# Altium schematic sheet sch.SchDoc
size A3
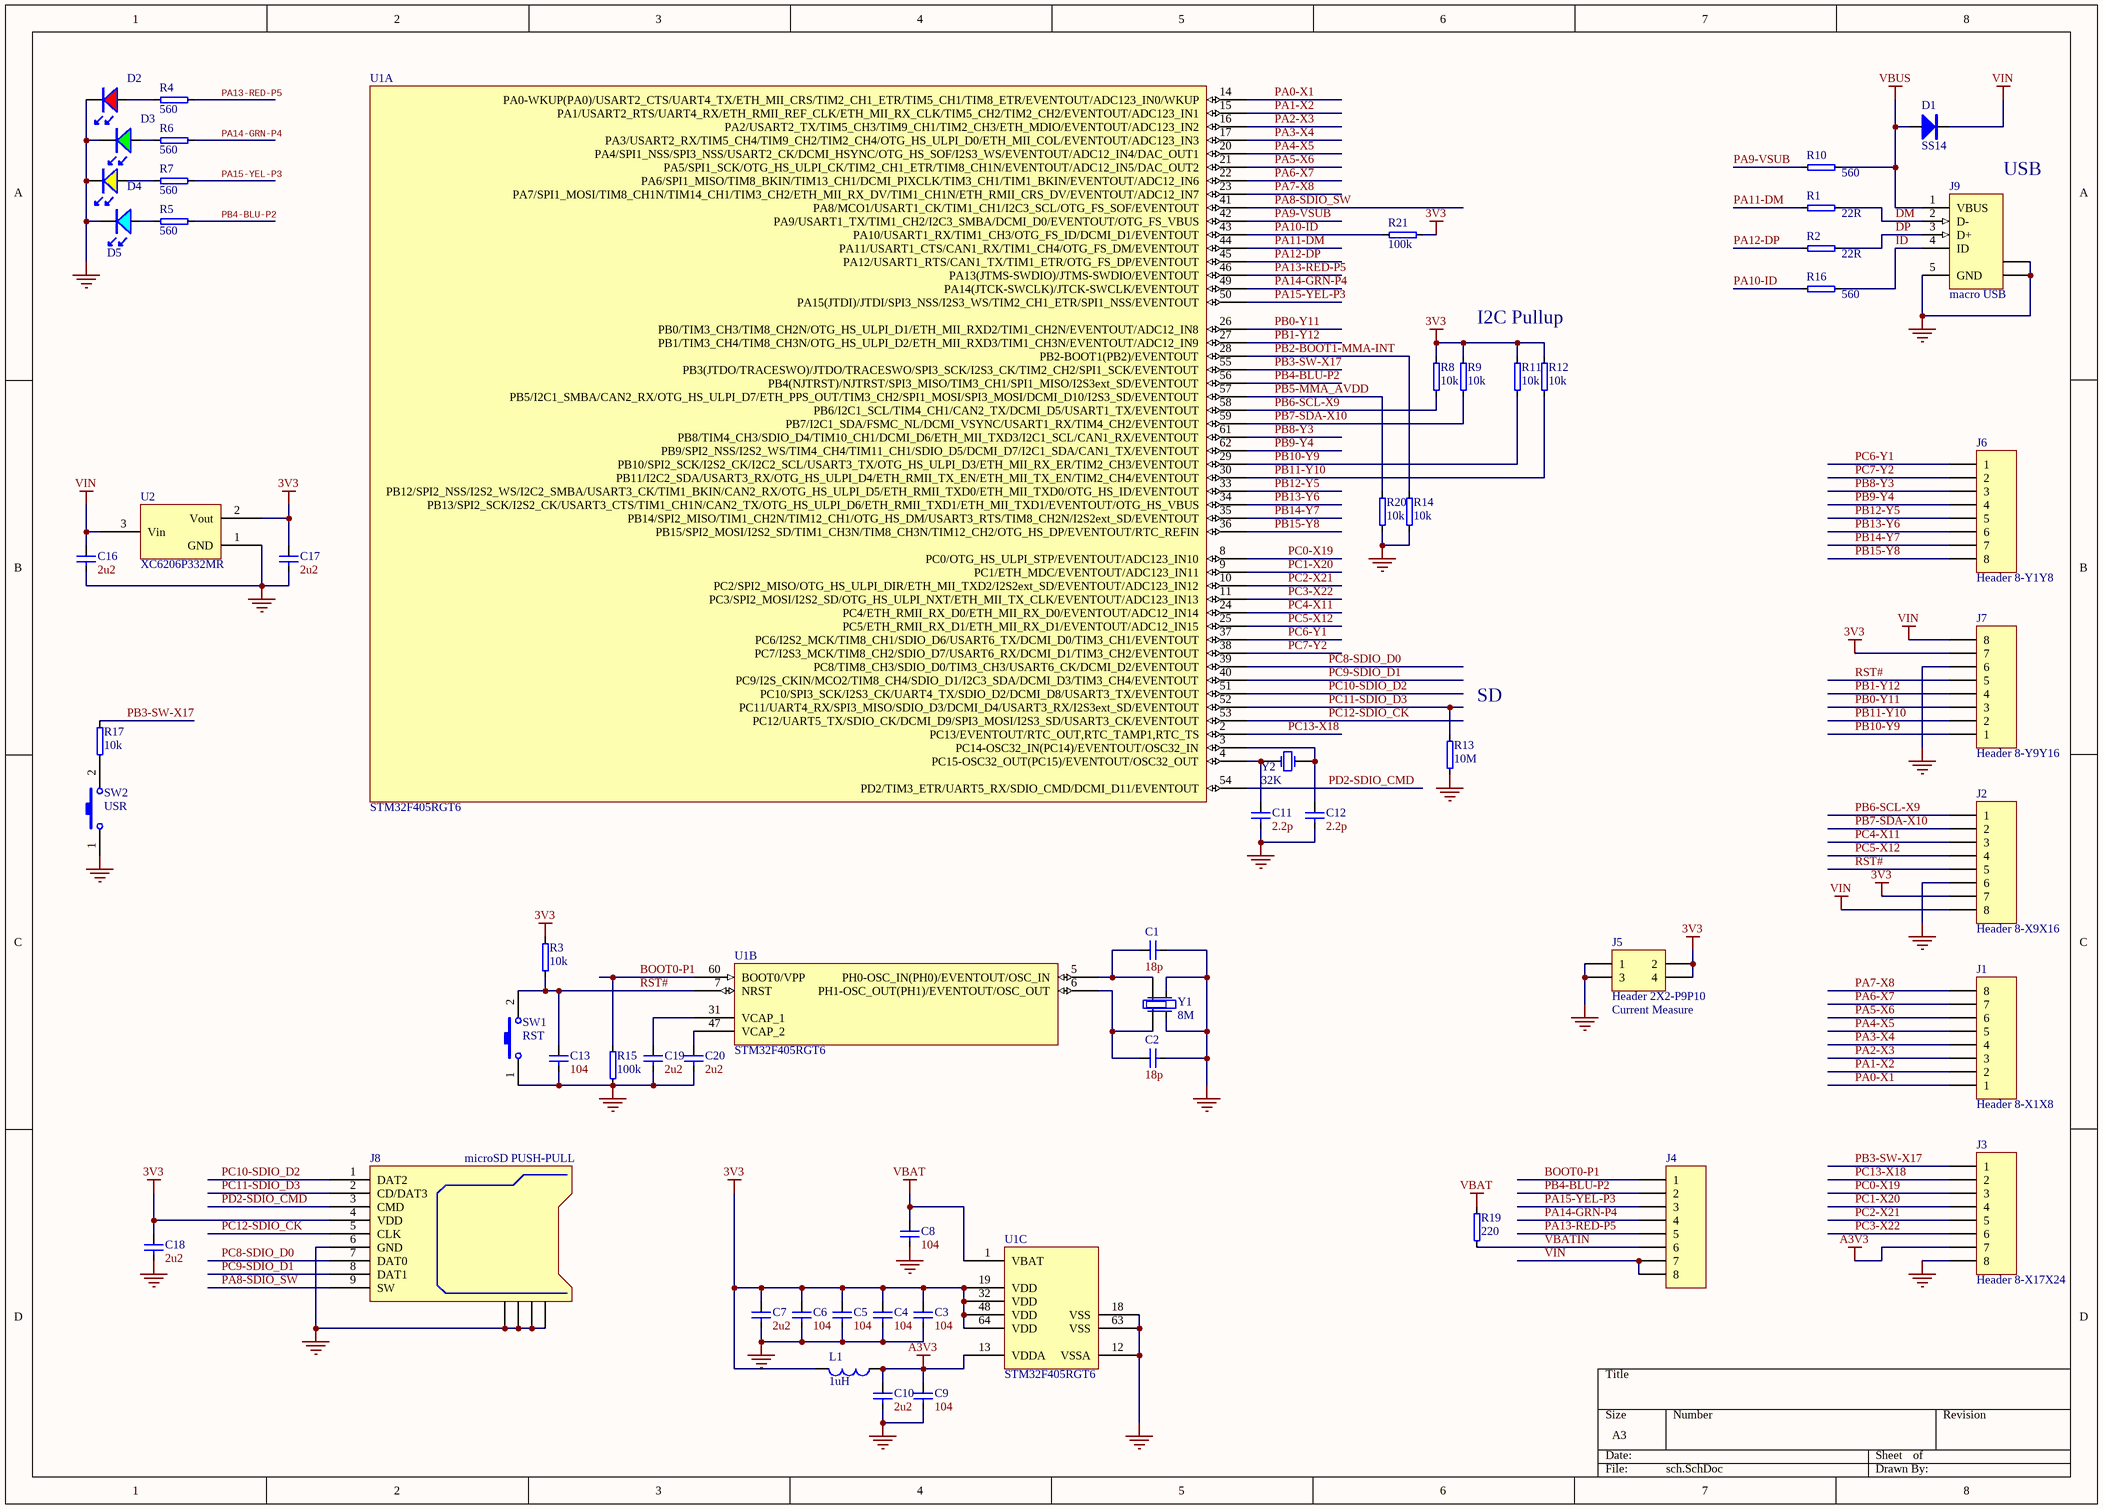
[diagram p0: sch.SchDoc]

## Parts
C1  18p  [SMD0603]
C2  18p  [SMD0603]
C3  104  [SMD0603]
C4  104  [SMD0603]
C5  104  [SMD0603]
C6  104  [SMD0603]
C7  2u2  [SMD0805]
C8  104  [SMD0603]
C9  104  [SMD0603]
C10  2u2  [SMD0805]
C11  2.2p  [SMD0603]
C12  2.2p  [SMD0603]
C13  104  [SMD0603]
C16  2u2  [SMD0805]
C17  2u2  [SMD0805]
C18  2u2  [SMD0805]
C19  2u2  [SMD0805]
C20  2u2  [SMD0805]
D1  SS14  [SS24 - small]
D2  LED RED  [LED0603]  (value not drawn)
D3  LED GREEN  [LED0603]  (value not drawn)
D4  LED Yellow  [LED0603]  (value not drawn)
D5  LED Blue  [LED0603]  (value not drawn)
J1  Header 8-X1X8  [HDR1X8]
J2  Header 8-X9X16  [HDR1X8]
J3  Header 8-X17X24  [HDR1X8]
J4  (no value)  [HDR1X8]
J5  Header 2X2-P9P10  [HDR2X2]
J6  Header 8-Y1Y8  [HDR1X8]
J7  Header 8-Y9Y16  [HDR1X8]
J8  microSD PUSH-PULL  [microSD-1]
J9  macro USB  [MicroUSB]
L1  1uH  [SMD0603]
R1  22R  [SMD0603]
R2  22R  [SMD0603]
R3  10k  [SMD0603]
R4  560  [SMD0603]
R5  560  [SMD0603]
R6  560  [SMD0603]
R7  560  [SMD0603]
R8  10k  [SMD0603]
R9  10k  [SMD0603]
R10  560  [SMD0603]
R11  10k  [SMD0603]
R12  10k  [SMD0603]
R13  10M  [SMD0603]
R14  10k  [SMD0603]
R15  100k  [SMD0603]
R16  560  [SMD0603]
R17  10k  [SMD0603]
R19  220  [SMD0603]
R20  10k  [SMD0603]
R21  100k  [SMD0603]
SW1  RST  [SW 3x6]
SW2  USR  [SW 3x6]
U1  STM32F405RGT6  [LQFP64_M]  (parts A,B,C of 3)
U2  XC6206P332MR  [SOT-23_N]
Y1  8M  [SMD5032]
Y2  32K  [TXC_9H03200019]

## Nets
3V3: C3.2 C4.2 C5.2 C6.2 C7.2 C17.2 C18.2 J2.7 J5.2 J5.4 J7.7 J8.4(VDD) L1.2 R3.2 R8.1 R9.1 R11.1 R12.1 R21.1 U1.19(VDD) U1.32(VDD) U1.48(VDD) U1.64(VDD) U2.2(Vout)
A3V3: C9.2 C10.2 J3.7 L1.1 U1.13(VDDA)
GND: C1.1 C2.1 C3.1 C4.1 C5.1 C6.1 C7.1 C8.1 C9.1 C10.1 C11.1 C12.1 C13.1 C16.1 C17.1 C18.1 C19.1 C20.1 D2.2 D3.2 D4.2 D5.2 J2.6 J3.8 J5.1 J5.3 J7.6 J8.6(GND) J8.GP1 J8.GP2 J8.GP3 J8.GP4 J9.5(GND) J9.6(SHLD) J9.7(SHLD) R13.2 R14.2 R15.1 R20.2 SW1.1 SW2.1 U1.12(VSSA) U1.18(VSS) U1.63(VSS) U2.1(GND) Y1.2(GND) Y1.4(GND)
VBAT: C8.2 R19.1 U1.1(VBAT)
VBUS: D1.1 J9.1(VBUS) R10.2
VIN: C16.2 D1.2 J2.8 J4.7 J4.8 J7.8 U2.3(Vin)
BOOT0-P1: J4.1 R15.2 U1.60(BOOT0/VPP)
DM: J9.2(D-) R1.2
DP: J9.3(D+) R2.2
ID: J9.4(ID) R16.2
PA0-X1: J1.1 U1.14(PA0-WKUP(PA0)/USART2_CTS/UART4_TX/ETH_MII_CRS/TIM2_CH1_ETR/TIM5_CH1/TIM8_ETR/EVENTOUT/ADC123_IN0/WKUP)
PA1-X2: J1.2 U1.15(PA1/USART2_RTS/UART4_RX/ETH_RMII_REF_CLK/ETH_MII_RX_CLK/TIM5_CH2/TIM2_CH2/EVENTOUT/ADC123_IN1)
PA2-X3: J1.3 U1.16(PA2/USART2_TX/TIM5_CH3/TIM9_CH1/TIM2_CH3/ETH_MDIO/EVENTOUT/ADC123_IN2)
PA3-X4: J1.4 U1.17(PA3/USART2_RX/TIM5_CH4/TIM9_CH2/TIM2_CH4/OTG_HS_ULPI_D0/ETH_MII_COL/EVENTOUT/ADC123_IN3)
PA4-X5: J1.5 U1.20(PA4/SPI1_NSS/SPI3_NSS/USART2_CK/DCMI_HSYNC/OTG_HS_SOF/I2S3_WS/EVENTOUT/ADC12_IN4/DAC_OUT1)
PA5-X6: J1.6 U1.21(PA5/SPI1_SCK/OTG_HS_ULPI_CK/TIM2_CH1_ETR/TIM8_CH1N/EVENTOUT/ADC12_IN5/DAC_OUT2)
PA6-X7: J1.7 U1.22(PA6/SPI1_MISO/TIM8_BKIN/TIM13_CH1/DCMI_PIXCLK/TIM3_CH1/TIM1_BKIN/EVENTOUT/ADC12_IN6)
PA7-X8: J1.8 U1.23(PA7/SPI1_MOSI/TIM8_CH1N/TIM14_CH1/TIM3_CH2/ETH_MII_RX_DV/TIM1_CH1N/ETH_RMII_CRS_DV/EVENTOUT/ADC12_IN7)
PA8-SDIO_SW: J8.9(SW) U1.41(PA8/MCO1/USART1_CK/TIM1_CH1/I2C3_SCL/OTG_FS_SOF/EVENTOUT)
PA9-VSUB: R10.1 U1.42(PA9/USART1_TX/TIM1_CH2/I2C3_SMBA/DCMI_D0/EVENTOUT/OTG_FS_VBUS)
PA10-ID: R16.1 R21.2 U1.43(PA10/USART1_RX/TIM1_CH3/OTG_FS_ID/DCMI_D1/EVENTOUT)
PA11-DM: R1.1 U1.44(PA11/USART1_CTS/CAN1_RX/TIM1_CH4/OTG_FS_DM/EVENTOUT)
PA12-DP: R2.1 U1.45(PA12/USART1_RTS/CAN1_TX/TIM1_ETR/OTG_FS_DP/EVENTOUT)
PA13-RED-P5: J4.5 R4.1 U1.46(PA13(JTMS-SWDIO)/JTMS-SWDIO/EVENTOUT)
PA14-GRN-P4: J4.4 R6.1 U1.49(PA14(JTCK-SWCLK)/JTCK-SWCLK/EVENTOUT)
PA15-YEL-P3: J4.3 R7.1 U1.50(PA15(JTDI)/JTDI/SPI3_NSS/I2S3_WS/TIM2_CH1_ETR/SPI1_NSS/EVENTOUT)
PB0-Y11: J7.3 U1.26(PB0/TIM3_CH3/TIM8_CH2N/OTG_HS_ULPI_D1/ETH_MII_RXD2/TIM1_CH2N/EVENTOUT/ADC12_IN8)
PB1-Y12: J7.4 U1.27(PB1/TIM3_CH4/TIM8_CH3N/OTG_HS_ULPI_D2/ETH_MII_RXD3/TIM1_CH3N/EVENTOUT/ADC12_IN9)
PB2-BOOT1-MMA-INT: R14.1 U1.28(PB2-BOOT1(PB2)/EVENTOUT)
PB3-SW-X17: J3.1 R17.2 U1.55(PB3(JTDO/TRACESWO)/JTDO/TRACESWO/SPI3_SCK/I2S3_CK/TIM2_CH2/SPI1_SCK/EVENTOUT)
PB4-BLU-P2: J4.2 R5.1 U1.56(PB4(NJTRST)/NJTRST/SPI3_MISO/TIM3_CH1/SPI1_MISO/I2S3ext_SD/EVENTOUT)
PB5-MMA_AVDD: R20.1 U1.57(PB5/I2C1_SMBA/CAN2_RX/OTG_HS_ULPI_D7/ETH_PPS_OUT/TIM3_CH2/SPI1_MOSI/SPI3_MOSI/DCMI_D10/I2S3_SD/EVENTOUT)
PB6-SCL-X9: J2.1 R8.2 U1.58(PB6/I2C1_SCL/TIM4_CH1/CAN2_TX/DCMI_D5/USART1_TX/EVENTOUT)
PB7-SDA-X10: J2.2 R9.2 U1.59(PB7/I2C1_SDA/FSMC_NL/DCMI_VSYNC/USART1_RX/TIM4_CH2/EVENTOUT)
PB8-Y3: J6.3 U1.61(PB8/TIM4_CH3/SDIO_D4/TIM10_CH1/DCMI_D6/ETH_MII_TXD3/I2C1_SCL/CAN1_RX/EVENTOUT)
PB9-Y4: J6.4 U1.62(PB9/SPI2_NSS/I2S2_WS/TIM4_CH4/TIM11_CH1/SDIO_D5/DCMI_D7/I2C1_SDA/CAN1_TX/EVENTOUT)
PB10-Y9: J7.1 R11.2 U1.29(PB10/SPI2_SCK/I2S2_CK/I2C2_SCL/USART3_TX/OTG_HS_ULPI_D3/ETH_MII_RX_ER/TIM2_CH3/EVENTOUT)
PB11-Y10: J7.2 R12.2 U1.30(PB11/I2C2_SDA/USART3_RX/OTG_HS_ULPI_D4/ETH_RMII_TX_EN/ETH_MII_TX_EN/TIM2_CH4/EVENTOUT)
PB12-Y5: J6.5 U1.33(PB12/SPI2_NSS/I2S2_WS/I2C2_SMBA/USART3_CK/TIM1_BKIN/CAN2_RX/OTG_HS_ULPI_D5/ETH_RMII_TXD0/ETH_MII_TXD0/OTG_HS_ID/EVENTOUT)
PB13-Y6: J6.6 U1.34(PB13/SPI2_SCK/I2S2_CK/USART3_CTS/TIM1_CH1N/CAN2_TX/OTG_HS_ULPI_D6/ETH_RMII_TXD1/ETH_MII_TXD1/EVENTOUT/OTG_HS_VBUS)
PB14-Y7: J6.7 U1.35(PB14/SPI2_MISO/TIM1_CH2N/TIM12_CH1/OTG_HS_DM/USART3_RTS/TIM8_CH2N/I2S2ext_SD/EVENTOUT)
PB15-Y8: J6.8 U1.36(PB15/SPI2_MOSI/I2S2_SD/TIM1_CH3N/TIM8_CH3N/TIM12_CH2/OTG_HS_DP/EVENTOUT/RTC_REFIN)
PC0-X19: J3.3 U1.8(PC0/OTG_HS_ULPI_STP/EVENTOUT/ADC123_IN10)
PC1-X20: J3.4 U1.9(PC1/ETH_MDC/EVENTOUT/ADC123_IN11)
PC2-X21: J3.5 U1.10(PC2/SPI2_MISO/OTG_HS_ULPI_DIR/ETH_MII_TXD2/I2S2ext_SD/EVENTOUT/ADC123_IN12)
PC3-X22: J3.6 U1.11(PC3/SPI2_MOSI/I2S2_SD/OTG_HS_ULPI_NXT/ETH_MII_TX_CLK/EVENTOUT/ADC123_IN13)
PC4-X11: J2.3 U1.24(PC4/ETH_RMII_RX_D0/ETH_MII_RX_D0/EVENTOUT/ADC12_IN14)
PC5-X12: J2.4 U1.25(PC5/ETH_RMII_RX_D1/ETH_MII_RX_D1/EVENTOUT/ADC12_IN15)
PC6-Y1: J6.1 U1.37(PC6/I2S2_MCK/TIM8_CH1/SDIO_D6/USART6_TX/DCMI_D0/TIM3_CH1/EVENTOUT)
PC7-Y2: J6.2 U1.38(PC7/I2S3_MCK/TIM8_CH2/SDIO_D7/USART6_RX/DCMI_D1/TIM3_CH2/EVENTOUT)
PC8-SDIO_D0: J8.7(DAT0) U1.39(PC8/TIM8_CH3/SDIO_D0/TIM3_CH3/USART6_CK/DCMI_D2/EVENTOUT)
PC9-SDIO_D1: J8.8(DAT1) U1.40(PC9/I2S_CKIN/MCO2/TIM8_CH4/SDIO_D1/I2C3_SDA/DCMI_D3/TIM3_CH4/EVENTOUT)
PC10-SDIO_D2: J8.1(DAT2) U1.51(PC10/SPI3_SCK/I2S3_CK/UART4_TX/SDIO_D2/DCMI_D8/USART3_TX/EVENTOUT)
PC11-SDIO_D3: J8.2(CD/DAT3) R13.1 U1.52(PC11/UART4_RX/SPI3_MISO/SDIO_D3/DCMI_D4/USART3_RX/I2S3ext_SD/EVENTOUT)
PC12-SDIO_CK: J8.5(CLK) U1.53(PC12/UART5_TX/SDIO_CK/DCMI_D9/SPI3_MOSI/I2S3_SD/USART3_CK/EVENTOUT)
PC13-X18: J3.2 U1.2(PC13/EVENTOUT/RTC_OUT,RTC_TAMP1,RTC_TS)
PD2-SDIO_CMD: J8.3(CMD) U1.54(PD2/TIM3_ETR/UART5_RX/SDIO_CMD/DCMI_D11/EVENTOUT)
RST#: C13.2 J2.5 J7.5 R3.1 SW1.2 U1.7(NRST)
VBATIN: J4.6 R19.2
NetC1_2: C1.2 U1.5(PH0-OSC_IN(PH0)/EVENTOUT/OSC_IN) Y1.3(OSC2)
NetC2_2: C2.2 U1.6(PH1-OSC_OUT(PH1)/EVENTOUT/OSC_OUT) Y1.1(OSC1)
NetC11_2: C11.2 U1.4(PC15-OSC32_OUT(PC15)/EVENTOUT/OSC32_OUT) Y2.1(OSC1)
NetC12_2: C12.2 U1.3(PC14-OSC32_IN(PC14)/EVENTOUT/OSC32_IN) Y2.2(OSC2)
NetC19_2: C19.2 U1.31(VCAP_1)
NetC20_2: C20.2 U1.47(VCAP_2)
NetD2_1: D2.1 R4.2
NetD3_1: D3.1 R6.2
NetD4_1: D4.1 R7.2
NetD5_1: D5.1 R5.2
NetR17_1: R17.1 SW2.2

## Notes on the sheet
- (near J9) USB
- I2C Pullup
- (near R13) SD
- (near J5) Current Measure

## Library data of the parts
C1-C13 C16-C20 = Cap
D1 = Diode
D2 = LED-RED: 红色发光二极管
D3 = LED-GREEN: 绿色发光二极管
D4 = LED-YELLOW: 黄色发光二极管
D5 = LED-BLUE: 蓝色发光二极管
J1-J4 J6 J7 = Header 8: Header, 8-Pin; LatestRevisionDate: 17-Jul-2002; LatestRevisionNote: Re-released for DXP Platform.; Publisher: Altium Limited
J5 = Header 2X2: Header, 2-Pin, Dual row; LatestRevisionDate: 17-Jul-2002; LatestRevisionNote: Re-released for DXP Platform.; Publisher: Altium Limited
J9 = macro USB: USB 2.0, Right Angle, SMT, B Type, Receptacle, 5 Position, Black; ContactMaterial: Copper Alloy; ContactPlating: Gold (30); PCB_Layout: Complies with manufacturer's recommendation.; DrillSize: Corresponds to nominal value.; PanelGround: Without; Published: 15-Jul-2004; DatasheetDocument: 27-Jun-2003; PackageDocument: 27-Jun-2003; PackageReference: 440247; Publisher: Altium Limited; HousingMaterial: Thermoplastic; ComponentLink1Description: Manufacturer Link; ComponentLink1URL: http://www.tycoelectronics.com/; ComponentLink2Description: Packaging Specification; ComponentLink2URL: http://ecommas.tycoelectronics.com/commerce/DocumentDelivery/DDEController?Action=showdoc&DocId=Customer+Drawing%7F440247%7FD%7Fpdf%7FEnglish%7FC_440247_D.pdf
L1 = Inductor: Code_IEC: 1005; Published: 8-Jun-2000; LatestRevisionDate: 17-Jul-2002; LatestRevisionNote: Re-released for DXP Platform.; PackageReference: 0402-A; Publisher: Altium Limited; Code_JEITA: 0402
R1-R17 R19-R21 = Res
SW1 SW2 = SW-PB: Switch; Published: 24-Mar-1999; LatestRevisionDate: 17-Jul-2002; LatestRevisionNote: Re-released for DXP Platform.; PackageReference: SPST-2; Publisher: Altium Limited; PackageDescription: Switch; 2 Leads
U2 = XC6206
Y1 = XTAL_SMD
Y2 = XTAL